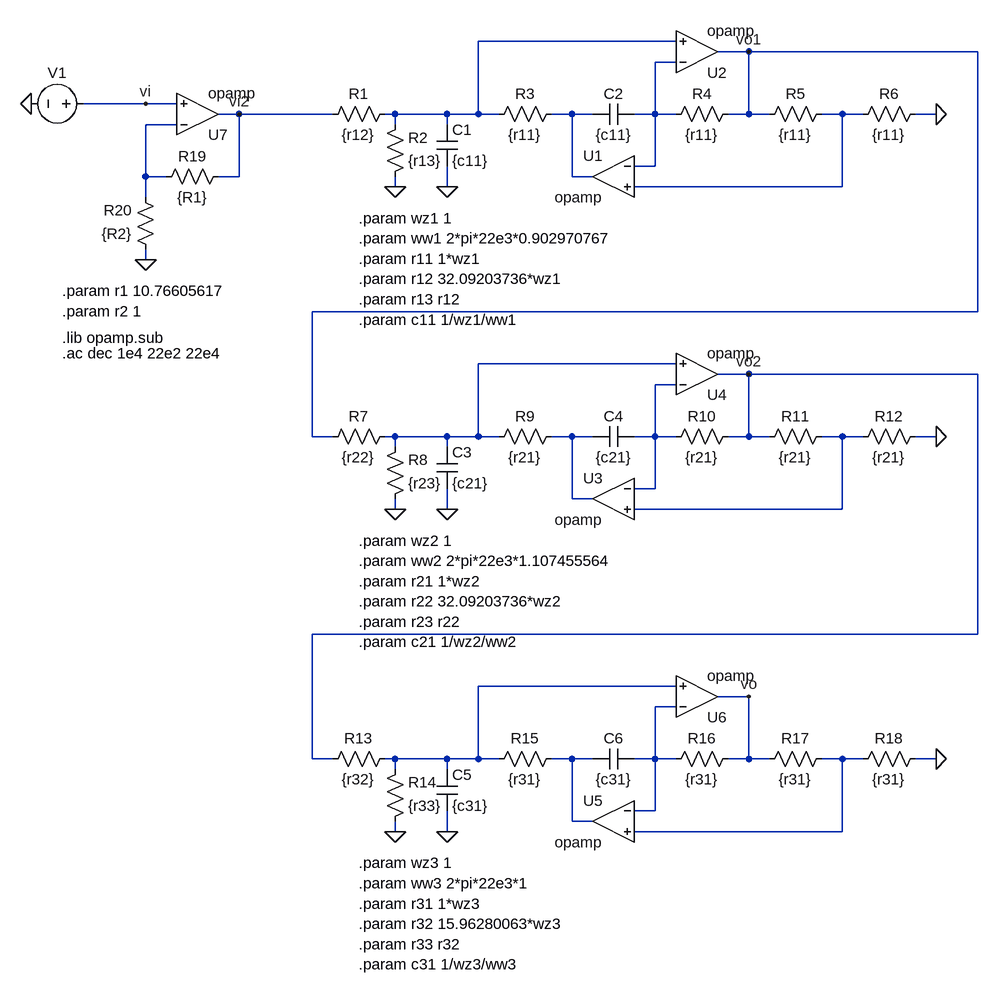
[diagram p0: schematic sim_activo.asc]
sim_activo.asc, the LTspice schematic file:
Version 4
SHEET 1 1108 1516
WIRE 640 128 336 128
WIRE 752 144 704 144
WIRE 1104 144 752 144
WIRE 640 160 608 160
WIRE -176 224 -272 224
WIRE -128 224 -176 224
WIRE -32 240 -64 240
WIRE 112 240 -32 240
WIRE 208 240 192 240
WIRE 288 240 208 240
WIRE 336 240 336 128
WIRE 336 240 288 240
WIRE 368 240 336 240
WIRE 480 240 448 240
WIRE 512 240 480 240
WIRE 608 240 608 160
WIRE 608 240 576 240
WIRE 640 240 608 240
WIRE 752 240 752 144
WIRE 752 240 720 240
WIRE 784 240 752 240
WIRE 896 240 864 240
WIRE 928 240 896 240
WIRE 1040 240 1008 240
WIRE -128 256 -176 256
WIRE 208 256 208 240
WIRE 288 256 288 240
WIRE 608 320 608 240
WIRE 608 320 576 320
WIRE -176 336 -176 256
WIRE -144 336 -176 336
WIRE -32 336 -32 240
WIRE -32 336 -64 336
WIRE 480 336 480 240
WIRE 512 336 480 336
WIRE 208 352 208 336
WIRE 288 352 288 320
WIRE 896 352 896 240
WIRE 896 352 576 352
WIRE -176 368 -176 336
WIRE -176 464 -176 448
WIRE 1104 544 1104 144
WIRE 1104 544 80 544
WIRE 640 624 336 624
WIRE 752 640 704 640
WIRE 1104 640 752 640
WIRE 640 656 608 656
WIRE 80 736 80 544
WIRE 112 736 80 736
WIRE 208 736 192 736
WIRE 288 736 208 736
WIRE 336 736 336 624
WIRE 336 736 288 736
WIRE 368 736 336 736
WIRE 480 736 448 736
WIRE 512 736 480 736
WIRE 608 736 608 656
WIRE 608 736 576 736
WIRE 640 736 608 736
WIRE 752 736 752 640
WIRE 752 736 720 736
WIRE 784 736 752 736
WIRE 896 736 864 736
WIRE 928 736 896 736
WIRE 1040 736 1008 736
WIRE 208 752 208 736
WIRE 288 752 288 736
WIRE 608 816 608 736
WIRE 608 816 576 816
WIRE 480 832 480 736
WIRE 512 832 480 832
WIRE 208 848 208 832
WIRE 288 848 288 816
WIRE 896 848 896 736
WIRE 896 848 576 848
WIRE 1104 1040 1104 640
WIRE 1104 1040 80 1040
WIRE 640 1120 336 1120
WIRE 752 1136 704 1136
WIRE 640 1152 608 1152
WIRE 80 1232 80 1040
WIRE 112 1232 80 1232
WIRE 208 1232 192 1232
WIRE 288 1232 208 1232
WIRE 336 1232 336 1120
WIRE 336 1232 288 1232
WIRE 368 1232 336 1232
WIRE 480 1232 448 1232
WIRE 512 1232 480 1232
WIRE 608 1232 608 1152
WIRE 608 1232 576 1232
WIRE 640 1232 608 1232
WIRE 752 1232 752 1136
WIRE 752 1232 720 1232
WIRE 784 1232 752 1232
WIRE 896 1232 864 1232
WIRE 928 1232 896 1232
WIRE 1040 1232 1008 1232
WIRE 208 1248 208 1232
WIRE 288 1248 288 1232
WIRE 608 1312 608 1232
WIRE 608 1312 576 1312
WIRE 480 1328 480 1232
WIRE 512 1328 480 1328
WIRE 208 1344 208 1328
WIRE 288 1344 288 1312
WIRE 896 1344 896 1232
WIRE 896 1344 576 1344
FLAG 1040 240 0
FLAG 288 352 0
FLAG 208 352 0
FLAG 1040 736 0
FLAG 288 848 0
FLAG 208 848 0
FLAG 1040 1232 0
FLAG 288 1344 0
FLAG 208 1344 0
FLAG 752 1136 vo
FLAG 752 640 vo2
FLAG 752 144 vo1
FLAG -176 464 0
FLAG -352 224 0
FLAG -176 224 vi
FLAG -32 240 vi2
SYMBOL res 208 224 R90
WINDOW 0 0 56 VBottom 2
WINDOW 3 32 56 VTop 2
SYMATTR InstName R1
SYMATTR Value {r12}
SYMBOL res 192 352 M180
WINDOW 0 36 76 Left 2
WINDOW 3 36 40 Left 2
SYMATTR InstName R2
SYMATTR Value {r13}
SYMBOL cap 272 256 R0
SYMATTR InstName C1
SYMATTR Value {c11}
SYMBOL res 464 224 R90
WINDOW 0 0 56 VBottom 2
WINDOW 3 32 56 VTop 2
SYMATTR InstName R3
SYMATTR Value {r11}
SYMBOL cap 576 224 R90
WINDOW 0 0 32 VBottom 2
WINDOW 3 32 32 VTop 2
SYMATTR InstName C2
SYMATTR Value {c11}
SYMBOL res 736 224 R90
WINDOW 0 0 56 VBottom 2
WINDOW 3 32 56 VTop 2
SYMATTR InstName R4
SYMATTR Value {r11}
SYMBOL res 880 224 R90
WINDOW 0 0 56 VBottom 2
WINDOW 3 32 56 VTop 2
SYMATTR InstName R5
SYMATTR Value {r11}
SYMBOL res 1024 224 R90
WINDOW 0 0 56 VBottom 2
WINDOW 3 32 56 VTop 2
SYMATTR InstName R6
SYMATTR Value {r11}
SYMBOL opamp 544 272 M0
SYMATTR InstName U1
SYMBOL opamp 672 208 M180
SYMATTR InstName U2
SYMBOL res 208 720 R90
WINDOW 0 0 56 VBottom 2
WINDOW 3 32 56 VTop 2
SYMATTR InstName R7
SYMATTR Value {r22}
SYMBOL res 192 848 M180
WINDOW 0 36 76 Left 2
WINDOW 3 36 40 Left 2
SYMATTR InstName R8
SYMATTR Value {r23}
SYMBOL cap 272 752 R0
SYMATTR InstName C3
SYMATTR Value {c21}
SYMBOL res 464 720 R90
WINDOW 0 0 56 VBottom 2
WINDOW 3 32 56 VTop 2
SYMATTR InstName R9
SYMATTR Value {r21}
SYMBOL cap 576 720 R90
WINDOW 0 0 32 VBottom 2
WINDOW 3 32 32 VTop 2
SYMATTR InstName C4
SYMATTR Value {c21}
SYMBOL res 736 720 R90
WINDOW 0 0 56 VBottom 2
WINDOW 3 32 56 VTop 2
SYMATTR InstName R10
SYMATTR Value {r21}
SYMBOL res 880 720 R90
WINDOW 0 0 56 VBottom 2
WINDOW 3 32 56 VTop 2
SYMATTR InstName R11
SYMATTR Value {r21}
SYMBOL res 1024 720 R90
WINDOW 0 0 56 VBottom 2
WINDOW 3 32 56 VTop 2
SYMATTR InstName R12
SYMATTR Value {r21}
SYMBOL opamp 544 768 M0
SYMATTR InstName U3
SYMBOL opamp 672 704 M180
SYMATTR InstName U4
SYMBOL res 208 1216 R90
WINDOW 0 0 56 VBottom 2
WINDOW 3 32 56 VTop 2
SYMATTR InstName R13
SYMATTR Value {r32}
SYMBOL res 192 1344 M180
WINDOW 0 36 76 Left 2
WINDOW 3 36 40 Left 2
SYMATTR InstName R14
SYMATTR Value {r33}
SYMBOL cap 272 1248 R0
SYMATTR InstName C5
SYMATTR Value {c31}
SYMBOL res 464 1216 R90
WINDOW 0 0 56 VBottom 2
WINDOW 3 32 56 VTop 2
SYMATTR InstName R15
SYMATTR Value {r31}
SYMBOL cap 576 1216 R90
WINDOW 0 0 32 VBottom 2
WINDOW 3 32 32 VTop 2
SYMATTR InstName C6
SYMATTR Value {c31}
SYMBOL res 736 1216 R90
WINDOW 0 0 56 VBottom 2
WINDOW 3 32 56 VTop 2
SYMATTR InstName R16
SYMATTR Value {r31}
SYMBOL res 880 1216 R90
WINDOW 0 0 56 VBottom 2
WINDOW 3 32 56 VTop 2
SYMATTR InstName R17
SYMATTR Value {r31}
SYMBOL res 1024 1216 R90
WINDOW 0 0 56 VBottom 2
WINDOW 3 32 56 VTop 2
SYMATTR InstName R18
SYMATTR Value {r31}
SYMBOL opamp 544 1264 M0
SYMATTR InstName U5
SYMBOL opamp 672 1200 M180
SYMATTR InstName U6
SYMBOL opamp -96 304 M180
SYMATTR InstName U7
SYMBOL res -48 320 R90
WINDOW 0 0 56 VBottom 2
WINDOW 3 32 56 VTop 2
SYMATTR InstName R19
SYMATTR Value {R1}
SYMBOL res -160 464 R180
WINDOW 0 36 76 Left 2
WINDOW 3 36 40 Left 2
SYMATTR InstName R20
SYMATTR Value {R2}
SYMBOL voltage -256 224 R90
WINDOW 0 -32 56 VBottom 2
WINDOW 3 32 56 VTop 2
SYMATTR InstName V1
SYMATTR Value ""
SYMATTR Value2 AC 1
TEXT 152 400 Left 2 !.param wz1 1\n.param ww1 2*pi*22e3*0.902970767\n.param r11 1*wz1\n.param r12 32.09203736*wz1\n.param r13 r12\n.param c11 1/wz1/ww1
TEXT 152 896 Left 2 !.param wz2 1\n.param ww2 2*pi*22e3*1.107455564\n.param r21 1*wz2\n.param r22 32.09203736*wz2\n.param r23 r22\n.param c21 1/wz2/ww2
TEXT 152 1392 Left 2 !.param wz3 1\n.param ww3 2*pi*22e3*1\n.param r31 1*wz3\n.param r32 15.96280063*wz3\n.param r33 r32\n.param c31 1/wz3/ww3
TEXT -304 512 Left 2 !.param r1 10.76605617\n.param r2 1
TEXT -304 584 Left 2 !.lib opamp.sub
TEXT -304 608 Left 2 !.ac dec 1e4 22e2 22e4

The netlist it stands for:
* sim_activo.asc
R1 N001 vi2 {r12}
R2 0 N001 {r13}
C1 N001 0 {c11}
R3 N003 N001 {r11}
C2 N002 N003 {c11}
R4 vo1 N002 {r11}
R5 N004 vo1 {r11}
R6 0 N004 {r11}
XU1 N002 N004 N003 opamp Aol=100K GBW=10Meg  ; pins invin noninvin out
XU2 N002 N001 vo1 opamp Aol=100K GBW=10Meg  ; pins invin noninvin out
R7 N006 vo1 {r22}
R8 0 N006 {r23}
C3 N006 0 {c21}
R9 N008 N006 {r21}
C4 N007 N008 {c21}
R10 vo2 N007 {r21}
R11 N009 vo2 {r21}
R12 0 N009 {r21}
XU3 N007 N009 N008 opamp Aol=100K GBW=10Meg  ; pins invin noninvin out
XU4 N007 N006 vo2 opamp Aol=100K GBW=10Meg  ; pins invin noninvin out
R13 N010 vo2 {r32}
R14 0 N010 {r33}
C5 N010 0 {c31}
R15 N012 N010 {r31}
C6 N011 N012 {c31}
R16 vo N011 {r31}
R17 N013 vo {r31}
R18 0 N013 {r31}
XU5 N011 N013 N012 opamp Aol=100K GBW=10Meg  ; pins invin noninvin out
XU6 N011 N010 vo opamp Aol=100K GBW=10Meg  ; pins invin noninvin out
XU7 N005 vi vi2 opamp Aol=100K GBW=10Meg  ; pins invin noninvin out
R19 vi2 N005 {R1}
R20 0 N005 {R2}
V1 vi 0 AC 1
.param wz1 1
.param ww1 2*pi*22e3*0.902970767
.param r11 1*wz1
.param r12 32.09203736*wz1
.param r13 r12
.param c11 1/wz1/ww1
.param wz2 1
.param ww2 2*pi*22e3*1.107455564
.param r21 1*wz2
.param r22 32.09203736*wz2
.param r23 r22
.param c21 1/wz2/ww2
.param wz3 1
.param ww3 2*pi*22e3*1
.param r31 1*wz3
.param r32 15.96280063*wz3
.param r33 r32
.param c31 1/wz3/ww3
.param r1 10.76605617
.param r2 1
.lib opamp.sub
.ac dec 1e4 22e2 22e4
.backanno
.end